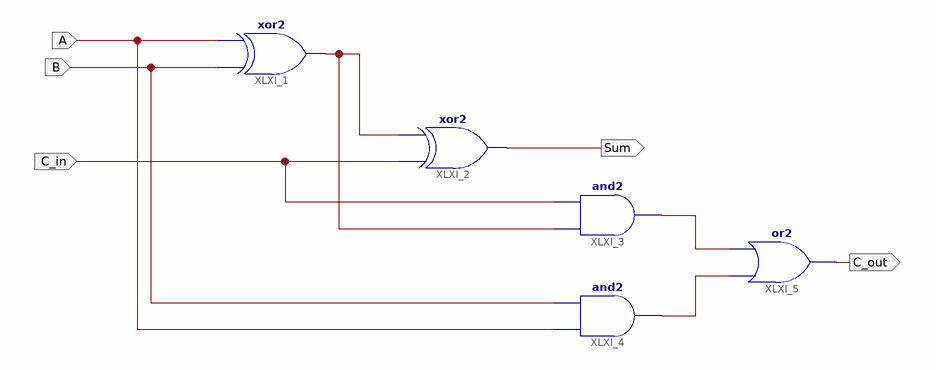
[diagram p0: schematic sheet 1]
// Xilinx ISE schematic fulladder.sch (spartan6) as structural Verilog: 5 symbols, 5 ports
module fulladder (
  input  C_in,
  input  B,
  input  A,
  output Sum,
  output C_out
);

  wire XLXN_1, XLXN_2, XLXN_3;

  xor XLXI_1 (XLXN_1, B, A);
  xor XLXI_2 (Sum, C_in, XLXN_1);
  and XLXI_3 (XLXN_2, XLXN_1, C_in);
  and XLXI_4 (XLXN_3, A, B);
  or XLXI_5 (C_out, XLXN_3, XLXN_2);
endmodule
